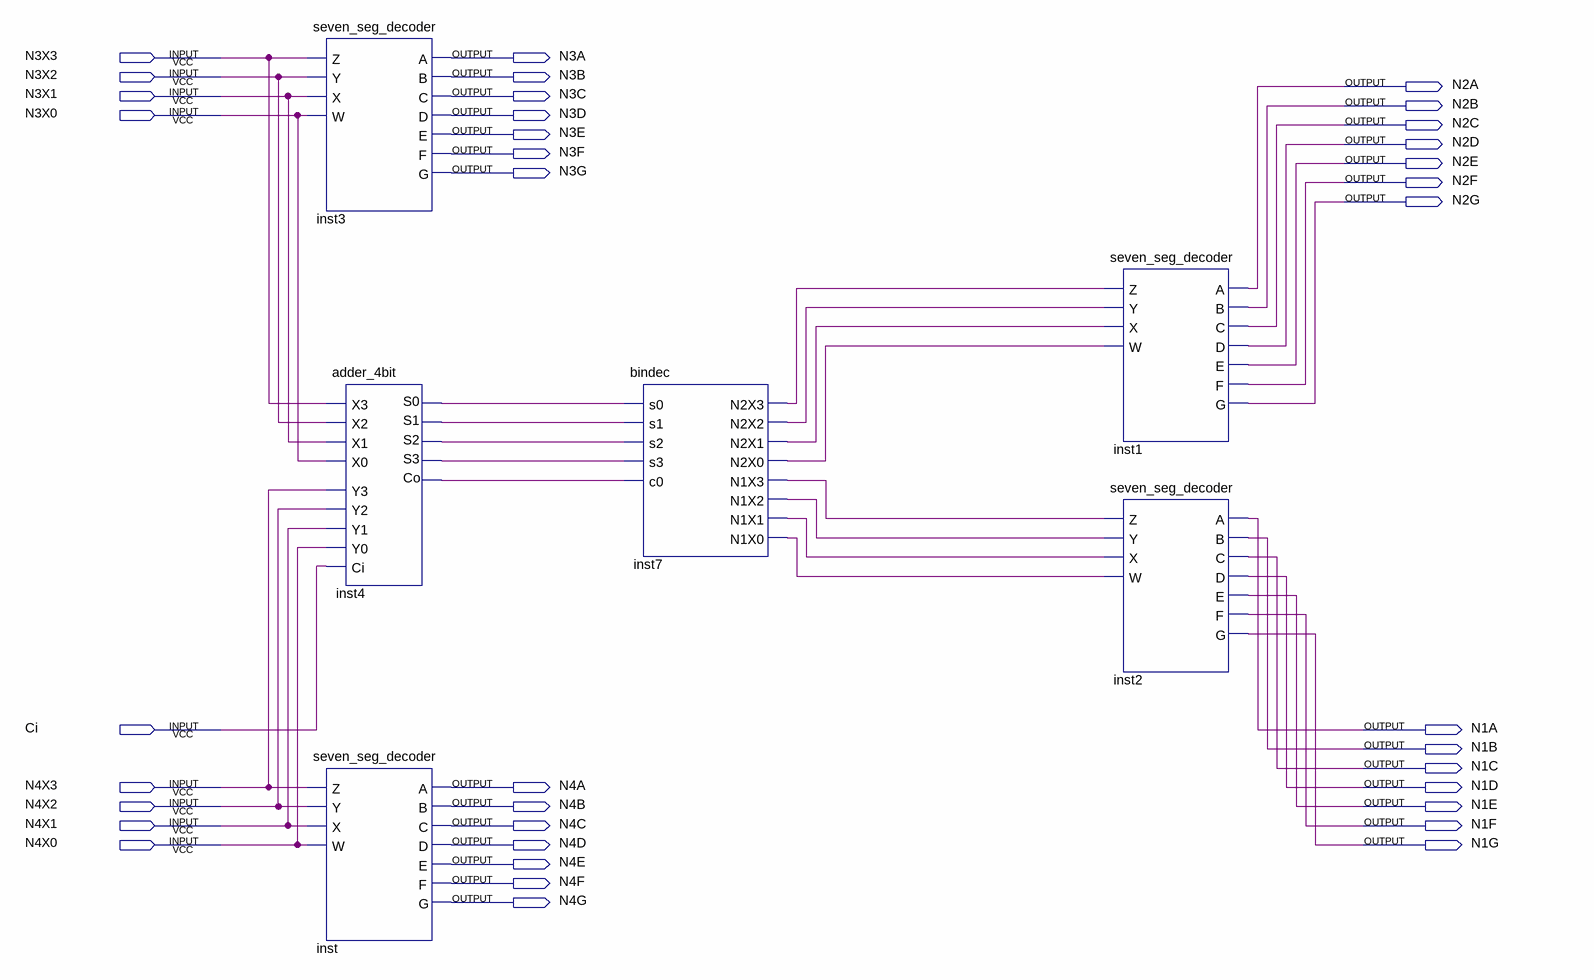
[diagram p0: schematic sheet]
// Quartus schematic Lab06.bdf as structural Verilog: 6 symbols, 37 pins
module Lab06 (
  input  N3X3,
  input  N3X2,
  input  N3X1,
  input  N3X0,
  input  Ci,
  input  N4X3,
  input  N4X2,
  input  N4X1,
  input  N4X0,
  output N3A,
  output N3B,
  output N2A,
  output N3C,
  output N2B,
  output N3D,
  output N2C,
  output N3E,
  output N2D,
  output N3F,
  output N2E,
  output N3G,
  output N2F,
  output N2G,
  output N1A,
  output N1B,
  output N1C,
  output N4A,
  output N1D,
  output N4B,
  output N1E,
  output N4C,
  output N1F,
  output N4D,
  output N1G,
  output N4E,
  output N4F,
  output N4G
);

  wire inst4_co, inst4_s0, inst4_s1, inst4_s2, inst4_s3, inst7_n1x0, inst7_n1x1, inst7_n1x2, inst7_n1x3,
       inst7_n2x0, inst7_n2x1, inst7_n2x2, inst7_n2x3;

  seven_seg_decoder inst3 (
    .Z(N3X3), .Y(N3X2), .X(N3X1), .W(N3X0), .A(N3A), .B(N3B), .C(N3C), .D(N3D), .E(N3E), .F(N3F), .G(N3G));
  seven_seg_decoder inst (
    .Z(N4X3), .Y(N4X2), .X(N4X1), .W(N4X0), .A(N4A), .B(N4B), .C(N4C), .D(N4D), .E(N4E), .F(N4F), .G(N4G));
  adder_4bit inst4 (
    .X3(N3X3), .Y3(N4X3), .X2(N3X2), .Y2(N4X2), .X1(N3X1), .Y1(N4X1), .X0(N3X0), .Y0(N4X0), .Ci(Ci),
    .S0(inst4_s0), .S1(inst4_s1), .S2(inst4_s2), .S3(inst4_s3), .Co(inst4_co));
  bindec inst7 (
    .s0(inst4_s0), .s1(inst4_s1), .s2(inst4_s2), .s3(inst4_s3), .c0(inst4_co), .N2X3(inst7_n2x3),
    .N2X2(inst7_n2x2), .N2X1(inst7_n2x1), .N2X0(inst7_n2x0), .N1X3(inst7_n1x3), .N1X2(inst7_n1x2),
    .N1X1(inst7_n1x1), .N1X0(inst7_n1x0));
  seven_seg_decoder inst1 (
    .Z(inst7_n2x3), .Y(inst7_n2x2), .X(inst7_n2x1), .W(inst7_n2x0), .A(N2A), .B(N2B), .C(N2C), .D(N2D),
    .E(N2E), .F(N2F), .G(N2G));
  seven_seg_decoder inst2 (
    .Z(inst7_n1x3), .Y(inst7_n1x2), .X(inst7_n1x1), .W(inst7_n1x0), .A(N1A), .B(N1B), .C(N1C), .D(N1D),
    .E(N1E), .F(N1F), .G(N1G));
endmodule
